# EAGLE design LineFollower (EAGLE 9.2.2)
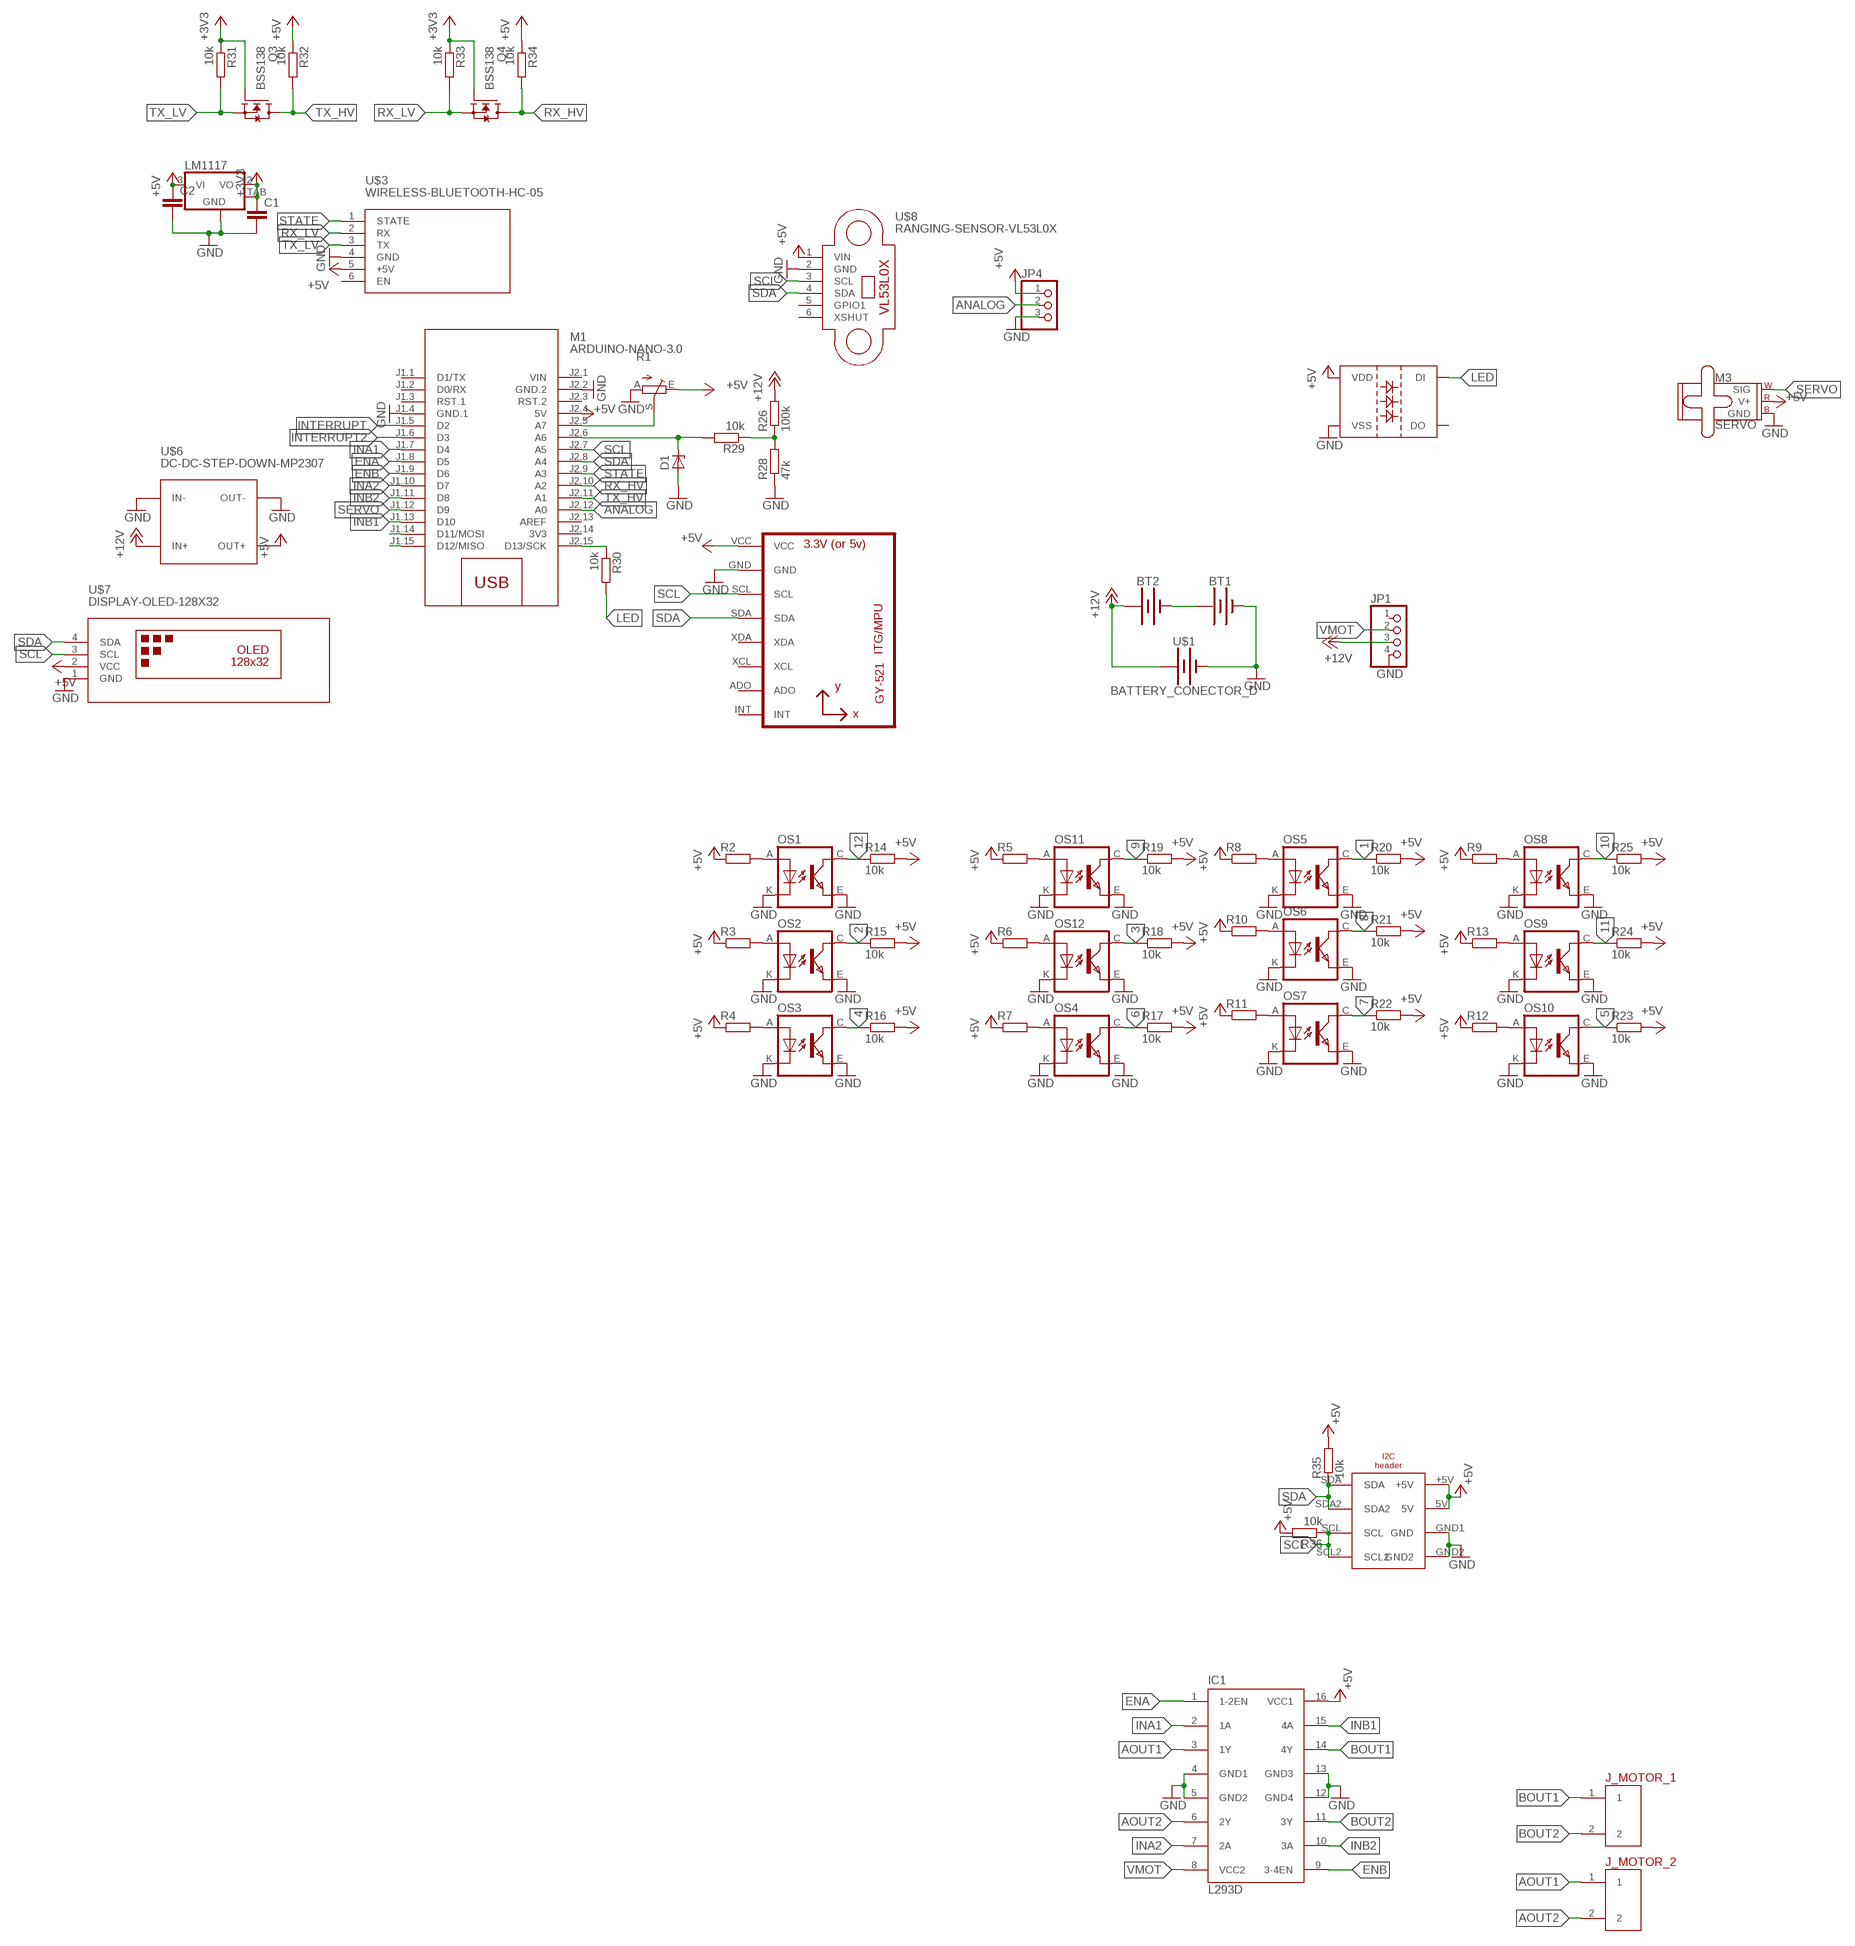
[diagram p0: schematic, sheet 1, part 1 of 2]
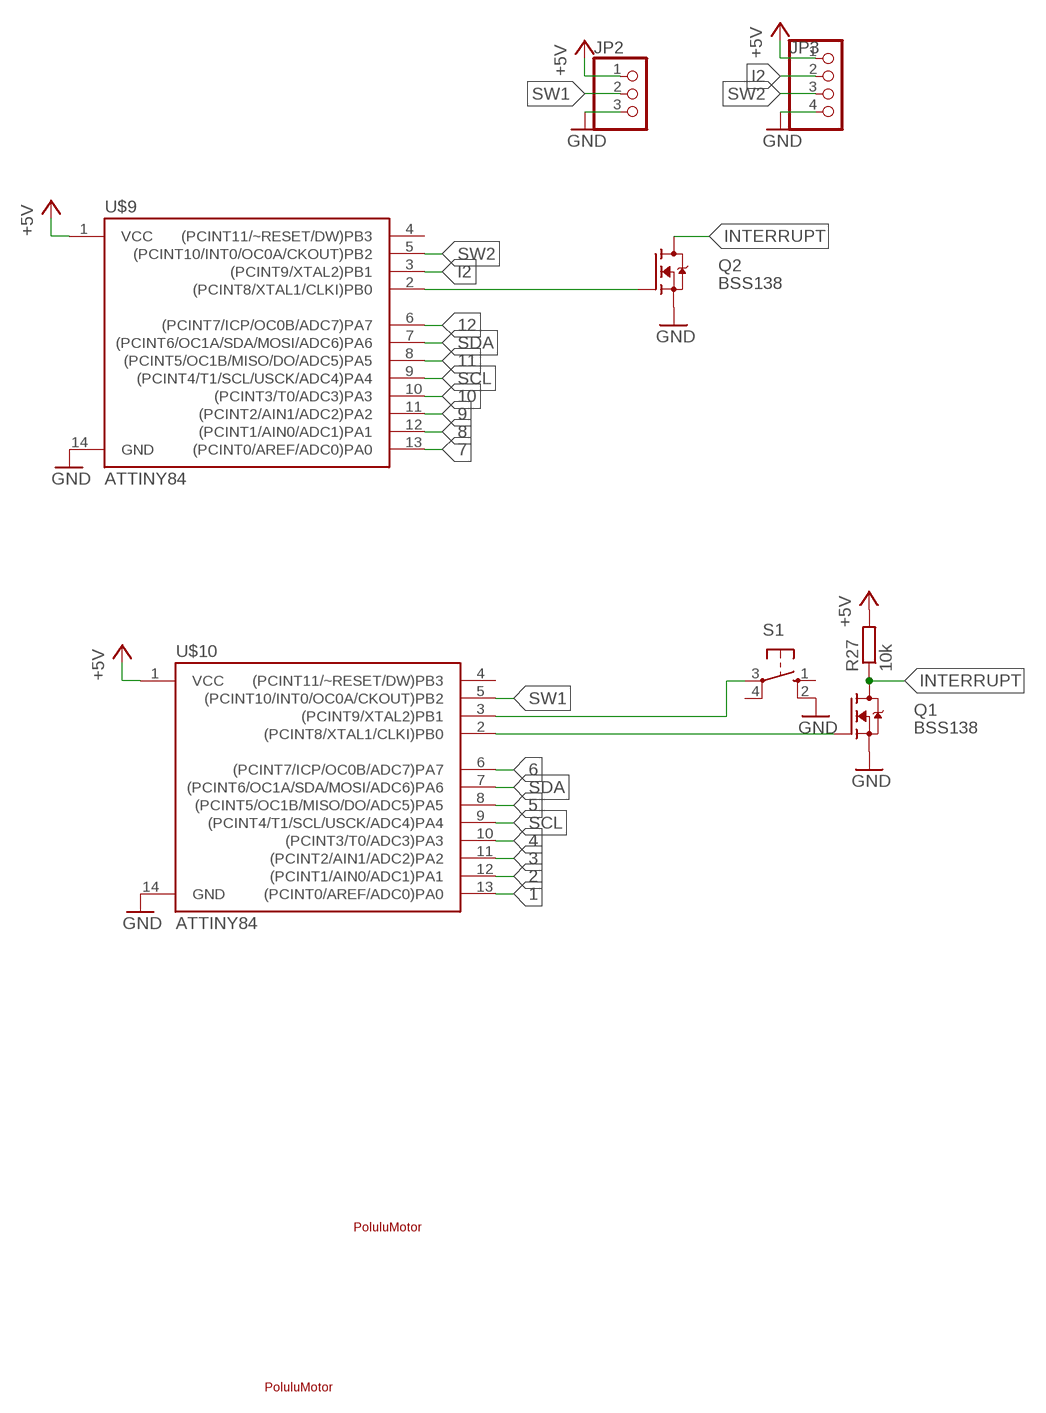
[diagram p1: schematic, sheet 1, part 2 of 2]

## Parts
BT1  BATTERY-AA_KIT  [BATTERY-AA-KIT]
BT2  BATTERY-AA_KIT  [BATTERY-AA-KIT]
C1  C-EUC1206  [C1206]
C2  C-EUC1206  [C1206]
D1  ZENER-DIODESOD80C  [SOD80C]
IC1  L293D  [L293]
J_MOTOR_1  MOTOR_CONNECTOR  [MOTOR_CONNECTOR_FOOTPRINT]
J_MOTOR_2  MOTOR_CONNECTOR  [MOTOR_CONNECTOR_FOOTPRINT]
JP1  PINHD-1X4  [1X04]
JP2  PINHD-1X3  [1X03]
JP3  PINHD-1X4  [1X04]
JP4  PINHD-1X3  [1X03]
LED1  WS2812B  [WS2812B]
M1  ARDUINO-NANO-3.0  [ARDUINO-NANO-3.0]
M3  SERVO  [1X03]
OS1  TCRT5000  [TCRT5000]
OS2  TCRT5000  [TCRT5000]
OS3  TCRT5000  [TCRT5000]
OS4  TCRT5000  [TCRT5000]
OS5  TCRT5000  [TCRT5000]
OS6  TCRT5000  [TCRT5000]
OS7  TCRT5000  [TCRT5000]
OS8  TCRT5000  [TCRT5000]
OS9  TCRT5000  [TCRT5000]
OS10  TCRT5000  [TCRT5000]
OS11  TCRT5000  [TCRT5000]
OS12  TCRT5000  [TCRT5000]
Q1  BSS138  [SOT23]
Q2  BSS138  [SOT23]
Q3  BSS138  [SOT23]
Q4  BSS138  [SOT23]
R1  TRIM_EU-RJ9W  [RJ9W]
R2  R-EU_M1206  [M1206]
R3  R-EU_M1206  [M1206]
R4  R-EU_M1206  [M1206]
R5  R-EU_M1206  [M1206]
R6  R-EU_M1206  [M1206]
R7  R-EU_M1206  [M1206]
R8  R-EU_M1206  [M1206]
R9  R-EU_M1206  [M1206]
R10  R-EU_M1206  [M1206]
R11  R-EU_M1206  [M1206]
R12  R-EU_M1206  [M1206]
R13  R-EU_M1206  [M1206]
R14  10k  R-EU_M1206  [M1206]
R15  10k  R-EU_M1206  [M1206]
R16  10k  R-EU_M1206  [M1206]
R17  10k  R-EU_M1206  [M1206]
R18  10k  R-EU_M1206  [M1206]
R19  10k  R-EU_M1206  [M1206]
R20  10k  R-EU_M1206  [M1206]
R21  10k  R-EU_M1206  [M1206]
R22  10k  R-EU_M1206  [M1206]
R23  10k  R-EU_M1206  [M1206]
R24  10k  R-EU_M1206  [M1206]
R25  10k  R-EU_M1206  [M1206]
R26  100k  R-EU_M1206  [M1206]
R27  10k  R-EU_M1206  [M1206]
R28  47k  R-EU_M1206  [M1206]
R29  10k  R-EU_M1206  [M1206]
R30  10k  R-EU_M1206  [M1206]
R31  10k  R-EU_M1206  [M1206]
R32  10k  R-EU_M1206  [M1206]
R33  10k  R-EU_M1206  [M1206]
R34  10k  R-EU_M1206  [M1206]
R35  10k  R-EU_M1206  [M1206]
R36  10k  R-EU_M1206  [M1206]
S1  10-XX  [B3F-10XX]
U1  MPU-6050MPU6050  [MPU-6050]
U$1  BATTERY_CONECTOR_D  [BATTERY_CONECTOR_D]
U$2  I2C_HEADER  [I2_HEADER]
U$3  WIRELESS-BLUETOOTH-HC-05  [WIRELESS-BLUETOOTH-HC-05]
U$4  LM1117  [LM1117]
U$6  DC-DC-STEP-DOWN-MP2307  [DC-DC-STEP-DOWN-MP2307]
U$7  DISPLAY-OLED-128X32  [DISPLAY-OLED-128X32]
U$8  RANGING-SENSOR-VL53L0X  [RANGING-SENSOR-VL53L0X]
U$9  ATTINY84  [SO14]
U$10  ATTINY84  [SO14]
U$12  POLULU_MOTOR  [POLULU_MOTOR]
U$13  POLULU_MOTOR  [POLULU_MOTOR]

## Nets
1: OS5.C(COLLECTOR) R20.1 U$10.13((PCINT0/AREF/ADC0)PA0)
2: OS2.C(COLLECTOR) R15.1 U$10.12((PCINT1/AIN0/ADC1)PA1)
3: OS12.C(COLLECTOR) R18.1 U$10.11((PCINT2/AIN1/ADC2)PA2)
4: OS3.C(COLLECTOR) R16.1 U$10.10((PCINT3/T0/ADC3)PA3)
5: OS10.C(COLLECTOR) R23.1 U$10.8((PCINT5/OC1B/MISO/DO/ADC5)PA5)
6: OS4.C(COLLECTOR) R17.1 U$10.6((PCINT7/ICP/OC0B/ADC7)PA7)
7: OS7.C(COLLECTOR) R22.1 U$9.13((PCINT0/AREF/ADC0)PA0)
8: OS6.C(COLLECTOR) R21.1 U$9.12((PCINT1/AIN0/ADC1)PA1)
9: OS11.C(COLLECTOR) R19.1 U$9.11((PCINT2/AIN1/ADC2)PA2)
10: OS8.C(COLLECTOR) R25.1 U$9.10((PCINT3/T0/ADC3)PA3)
11: OS9.C(COLLECTOR) R24.1 U$9.8((PCINT5/OC1B/MISO/DO/ADC5)PA5)
12: OS1.C(COLLECTOR) R14.1 U$9.6((PCINT7/ICP/OC0B/ADC7)PA7)
+3V3: C1.1 Q3.1(G) Q4.1(G) R31.1 R33.1 U$4.2(VO) U$4.TAB(OUT)
+5V: C2.1 IC1.16(VCC1) JP2.1 JP3.1 JP4.1 LED1.1(VDD) M1.J2.4(5V) M3.2(V+) R1.E R2.1 R3.1 R4.1 R5.1 R6.1 R7.1 R8.1 R9.1 R10.1 R11.1 R12.1 R13.1 R14.2 R15.2 R16.2 R17.2 R18.2 R19.2 R20.2 R21.2 R22.2 R23.2 R24.2 R25.2 R27.2 R32.1 R34.1 R35.2 R36.2 U1.VCC U$2.5V U$2.+5V U$3.5(+5V) U$4.3(VI) U$6.OUT+ U$7.2(VCC) U$8.1(VIN) U$9.1(VCC) U$10.1(VCC)
+12V: BT2.PWR@1(+) JP1.3 R26.2 U$1.+ U$6.IN+
ANALOG: JP4.2 M1.J2.12(A0)
AOUT1: IC1.3(1Y) J_MOTOR_2.1
AOUT2: IC1.6(2Y) J_MOTOR_2.2
BOUT1: IC1.14(4Y) J_MOTOR_1.1
BOUT2: IC1.11(3Y) J_MOTOR_1.2
ENA: IC1.1(1-2EN) M1.J1.8(D5)
ENB: IC1.9(3-4EN) M1.J1.9(D6)
GND: BT1.GND@1(-) C1.2 C2.2 D1.A IC1.4(GND1) IC1.5(GND2) IC1.12(GND4) IC1.13(GND3) JP1.4 JP2.3 JP3.4 JP4.3 LED1.3(VSS) M1.J1.4(GND.1) M1.J2.2(GND.2) M3.3(GND) OS1.E(EMITTER) OS1.K(CATHODE) OS2.E(EMITTER) OS2.K(CATHODE) OS3.E(EMITTER) OS3.K(CATHODE) OS4.E(EMITTER) OS4.K(CATHODE) OS5.E(EMITTER) OS5.K(CATHODE) OS6.E(EMITTER) OS6.K(CATHODE) OS7.E(EMITTER) OS7.K(CATHODE) OS8.E(EMITTER) OS8.K(CATHODE) OS9.E(EMITTER) OS9.K(CATHODE) OS10.E(EMITTER) OS10.K(CATHODE) OS11.E(EMITTER) OS11.K(CATHODE) OS12.E(EMITTER) OS12.K(CATHODE) Q1.2(S) Q2.2(S) R1.A R28.1 S1.2(S1) U1.GND U$1.- U$2.GND1(GND) U$2.GND2 U$3.4(GND) U$4.1(GND) U$6.IN- U$6.OUT- U$7.1(GND) U$8.2(GND) U$9.14(GND) U$10.14(GND)
I2: JP3.2 U$9.3((PCINT9/XTAL2)PB1)
INA1: IC1.2(1A) M1.J1.7(D4)
INA2: IC1.7(2A) M1.J1.10(D7)
INB1: IC1.15(4A) M1.J1.13(D10)
INB2: IC1.10(3A) M1.J1.11(D8)
INTERRUPT: M1.J1.5(D2) Q1.3(D) Q2.3(D) R27.1
INTERRUPT2: M1.J1.6(D3)
LED: LED1.4(DI) R30.2
N$1: M1.J2.5(A7) R1.S
N$2: BT1.PWR@1(+) BT2.GND@1(-)
N$3: Q1.1(G) U$10.2((PCINT8/XTAL1/CLKI)PB0)
N$4: Q2.1(G) U$9.2((PCINT8/XTAL1/CLKI)PB0)
N$5: S1.3(P) U$10.3((PCINT9/XTAL2)PB1)
N$6: R26.1 R28.2 R29.1
N$7: OS1.A(ANODE) R2.2
N$8: OS2.A(ANODE) R3.2
N$9: OS3.A(ANODE) R4.2
N$10: OS11.A(ANODE) R5.2
N$11: OS12.A(ANODE) R6.2
N$12: OS4.A(ANODE) R7.2
N$13: OS5.A(ANODE) R8.2
N$14: OS6.A(ANODE) R10.2
N$15: OS7.A(ANODE) R11.2
N$16: OS10.A(ANODE) R12.2
N$17: OS9.A(ANODE) R13.2
N$18: OS8.A(ANODE) R9.2
N$19: D1.C M1.J2.6(A6) R29.2
N$20: M1.J2.15(D13/SCK) R30.1
N$21: M1.J1.15(D12/MISO)
N$22: M1.J1.14(D11/MOSI)
RX_HV: M1.J2.10(A2) Q4.3(D) R34.2
RX_LV: Q4.2(S) R33.2 U$3.2(RX)
SCL: M1.J2.7(A5) R36.1 U1.SCL U$2.SCL U$2.SCL2 U$7.3(SCL) U$8.3(SCL) U$9.9((PCINT4/T1/SCL/USCK/ADC4)PA4) U$10.9((PCINT4/T1/SCL/USCK/ADC4)PA4)
SDA: M1.J2.8(A4) R35.1 U1.SDA U$2.SDA U$2.SDA2 U$7.4(SDA) U$8.4(SDA) U$9.7((PCINT6/OC1A/SDA/MOSI/ADC6)PA6) U$10.7((PCINT6/OC1A/SDA/MOSI/ADC6)PA6)
SERVO: M1.J1.12(D9) M3.1(SIG)
STATE: M1.J2.9(A3) U$3.1(STATE)
SW1: JP2.2 U$10.5((PCINT10/INT0/OC0A/CKOUT)PB2)
SW2: JP3.3 U$9.5((PCINT10/INT0/OC0A/CKOUT)PB2)
TX_HV: M1.J2.11(A1) Q3.3(D) R32.2
TX_LV: Q3.2(S) R31.2 U$3.3(TX)
VMOT: IC1.8(VCC2) JP1.2
Unconnected: JP1.1 LED1.2(DO) M1.J1.1(D1/TX) M1.J1.2(D0/RX) M1.J1.3(RST.1) M1.J2.3(RST.2) M1.J2.13(AREF) S1.1(S) S1.4(P1) U1.ADO U1.INT U1.XCL U1.XDA U$3.6(EN) U$8.5(GPIO1) U$8.6(XSHUT) U$9.4((PCINT11/~RESET/DW)PB3) U$10.4((PCINT11/~RESET/DW)PB3)

## Power pins joined to a net without a drawn wire
3V3: M1.J2.14(3V3)
VIN: M1.J2.1(VIN)

## Library data of the parts
BT1 BT2 = Cing Library:BATTERY: Battery - Single Cell A variety of battery chemistries, sizes, and footprints. Device List: 20MM_PTH - Coin Cell Battery Holder - 20mm (PTH) <https://www.sparkfun.com/products/783> 6.8MM_PTH - Coin Cell Battery Holder - 6.8MM(SMD) <https://www.digikey.com/product-detail/en/seiko-instruments/MS621FE-FL11E/728-1057-ND/1889208?WT.srch=1&gclid=CNOQ5a6LzdQCFZS2wAodXCkE0g> 12MM_SMD - Coin Cell Battery Holder - 12mm (SMD) <https://www.sparkfun.com/products/10592> 12MM_PTH - Coin Cell Battery Holder - 12mm (PTH) <https://www.sparkfun.com/products/7948> 20MM_SMD - 20mm Coin Cell Battery Holder (SMD) (2 legs) Used on the Big Time Watch Kit <https://www.sparkfun.com/products/11734> 20MM_SMD_4LEGS - Coin Cell Battery Holder - 20mm (SMD) <https://www.sparkfun.com/products/11892> 20MM_SMD_4LEGS_OVERPASTE - Coin Cell Battery Holder - 20mm (SMD) <https://www.sparkfun.com/products/11892> (Over-paste on the legs) 24.5MM_PTH - Coin Cell Battery Holder - 24.5mm (PTH) <https://www.sparkfun.com/products/8863> 9V - 9V Battery Holder - PC Mount Used on the SparkFun SparkPunk Sound Kit <https://www.sparkfun.com/products/11177> and SparkFun SparkPunk Sequencer Kit <https://www.sparkfun.com/products/12707> 18650 - Battery Holder - 18650 (PTH) <https://www.sparkfun.com/products/13113> AA - Battery Holder - 1xAA (PTH) <https://www.sparkfun.com/products/7949> AAA - Battery Holder - 1xAAA (PTH) <https://www.sparkfun.com/products/12718> AA_KIT - Battery Holder - 1xAA (PTH) <https://www.sparkfun.com/products/7949> Special kit package - pads only have exposed copper on one side of the board. AAA_KIT - Battery Holder - 1xAAA (PTH) <https://www.sparkfun.com/products/12718> Special kit package - pads only have exposed copper on one side of the board.; PROD_ID: BATT-08316; SF_SKU: PRT-07949
C1 C2 = rcl:C-EU: CAPACITOR, European symbol; SPICEPREFIX: C
D1 = diode:ZENER-DIODE: Z-Diode
IC1 = Cing Library:L293D: PUSH-PULL 4 CHANNEL DRIVER; MPN: L293D; OC_FARNELL: 9589619; OC_NEWARK: 56P8249
J_MOTOR_1 J_MOTOR_2 = Pololu Encoder and Motor Driver:MOTOR_CONNECTOR: Connector for a Motor
JP1 JP3 = pinhead:PINHD-1X4: PIN HEADER
JP2 JP4 = pinhead:PINHD-1X3: PIN HEADER
LED1 = Cing Library:WS2812B
M1 = diy-modules:ARDUINO-NANO-3.0: Arduino Nano 3.0 and compatible devices More details available here: https://www.arduino.cc/en/Main/ArduinoBoardNano Click here to find device on ebay.com <http://www.ebay.com/sch/arduino+nano>
M3 = SparkFun-Electromechanical:SERVO: Servo Motor 3-pin connector for a standard servo motor (voltage supply, ground, and control signal.) SparkFun Products Servo - Generic (Sub-Micro Size) <https://www.sparkfun.com/products/9065> (ROB-09065) Servo - Generic High Torque Continuous Rotation (Standard Size) <https://www.sparkfun.com/products/9347> (ROB-09347) Servo - Generic High Torque (Standard Size) <https://www.sparkfun.com/products/11965> (ROB-11965)
OS1-OS12 = Cing Library:TCRT5000
Q1-Q4 = Cing Library:BSS138: BSS138 N-Channel Logic Level Enhancement Mode Field Effect Transistor Source: http://www.fairchildsemi.com/datasheets/BS/BSS138.pdf; MF: Fairchild; MPN: BSS138; OC_FARNELL: 9845330; OC_NEWARK: 67R2009
R1 = pot:TRIM_EU-: POTENTIOMETER
R2-R36 = rcl:R-EU_: RESISTOR, European symbol; SPICEPREFIX: R
S1 = switch-omron:10-XX: OMRON SWITCH; MPN: B3F-1000; OC_FARNELL: 176432; OC_NEWARK: 36M3542
U1 = Cing Library:MPU-6050
U$1 = Cing Library:BATTERY_CONECTOR_D
U$2 = Cing Library:I2C_HEADER
U$3 = Cing Library:WIRELESS-BLUETOOTH-HC-05: Bluetooth Transceiver Module based on HC-05 board Tutorial is available here: https://arduino-info.wikispaces.com/BlueTooth-HC05-HC06-Modules-How-To Click here to find device on ebay.com <http://www.ebay.com/sch/hc-05+module+rs232>
U$4 = Cing Library:LM1117
U$6 = diy-modules:DC-DC-STEP-DOWN-MP2307: DC/DC Step-Down Regulator based on MP2307DN chip MP2307 datasheet available here: https://cdn-shop.adafruit.com/datasheets/MP2307_r1.9.pdf Click here to find device on ebay.com <http://www.ebay.com/sch/dc+dc+3a+mini+converter>
U$7 = diy-modules:DISPLAY-OLED-128X32: 128x32 Dot Matrix OLED Module with I2C interface based on SSD1306 chip More details available here: http://www.tinyosshop.com/index.php?route=product/product&product_id=953 Schematic available here: http://www.tinyosshop.com/datasheet/OLED%2012832.pdf SSD1306 datasheet: https://cdn-shop.adafruit.com/datasheets/SSD1306.pdf Click here to find device on ebay.com <http://www.ebay.com/sch/oled+display+128x32+i2c>
U$8 = diy-modules:RANGING-SENSOR-VL53L0X: Laser Ranging Sensor based on VL53L0X device More information about VL53L0X device can be found here: http://www.st.com/en/imaging-and-photonics-solutions/vl53l0x.html Arduino Library for VL53L0X is available here: https://github.com/pololu/vl53l0x-arduino Click here to find device on ebay.com <http://www.ebay.com/sch/GY+VL53L0X+module> Note: There are many variants. Search for the proper version.
U$9 U$10 = SparkFun-IC-Microcontroller:ATTINY84: Atmel 14-pin 2/4/8kB flash uC Datasheet <https://cdn.sparkfun.com/datasheets/Widgets/doc8006.pdf> SparkFun Products Tiny AVR Programmer <https://www.sparkfun.com/products/11801> (PGM-11801) SparkFun Servo Trigger - Continuous Rotation <https://www.sparkfun.com/products/13872> (WIG-13872) SparkFun Servo Trigger <https://www.sparkfun.com/products/13118> (WIG-13118); PROD_ID: IC-11285
U$12 U$13 = Cing Library:POLULU_MOTOR

## Board
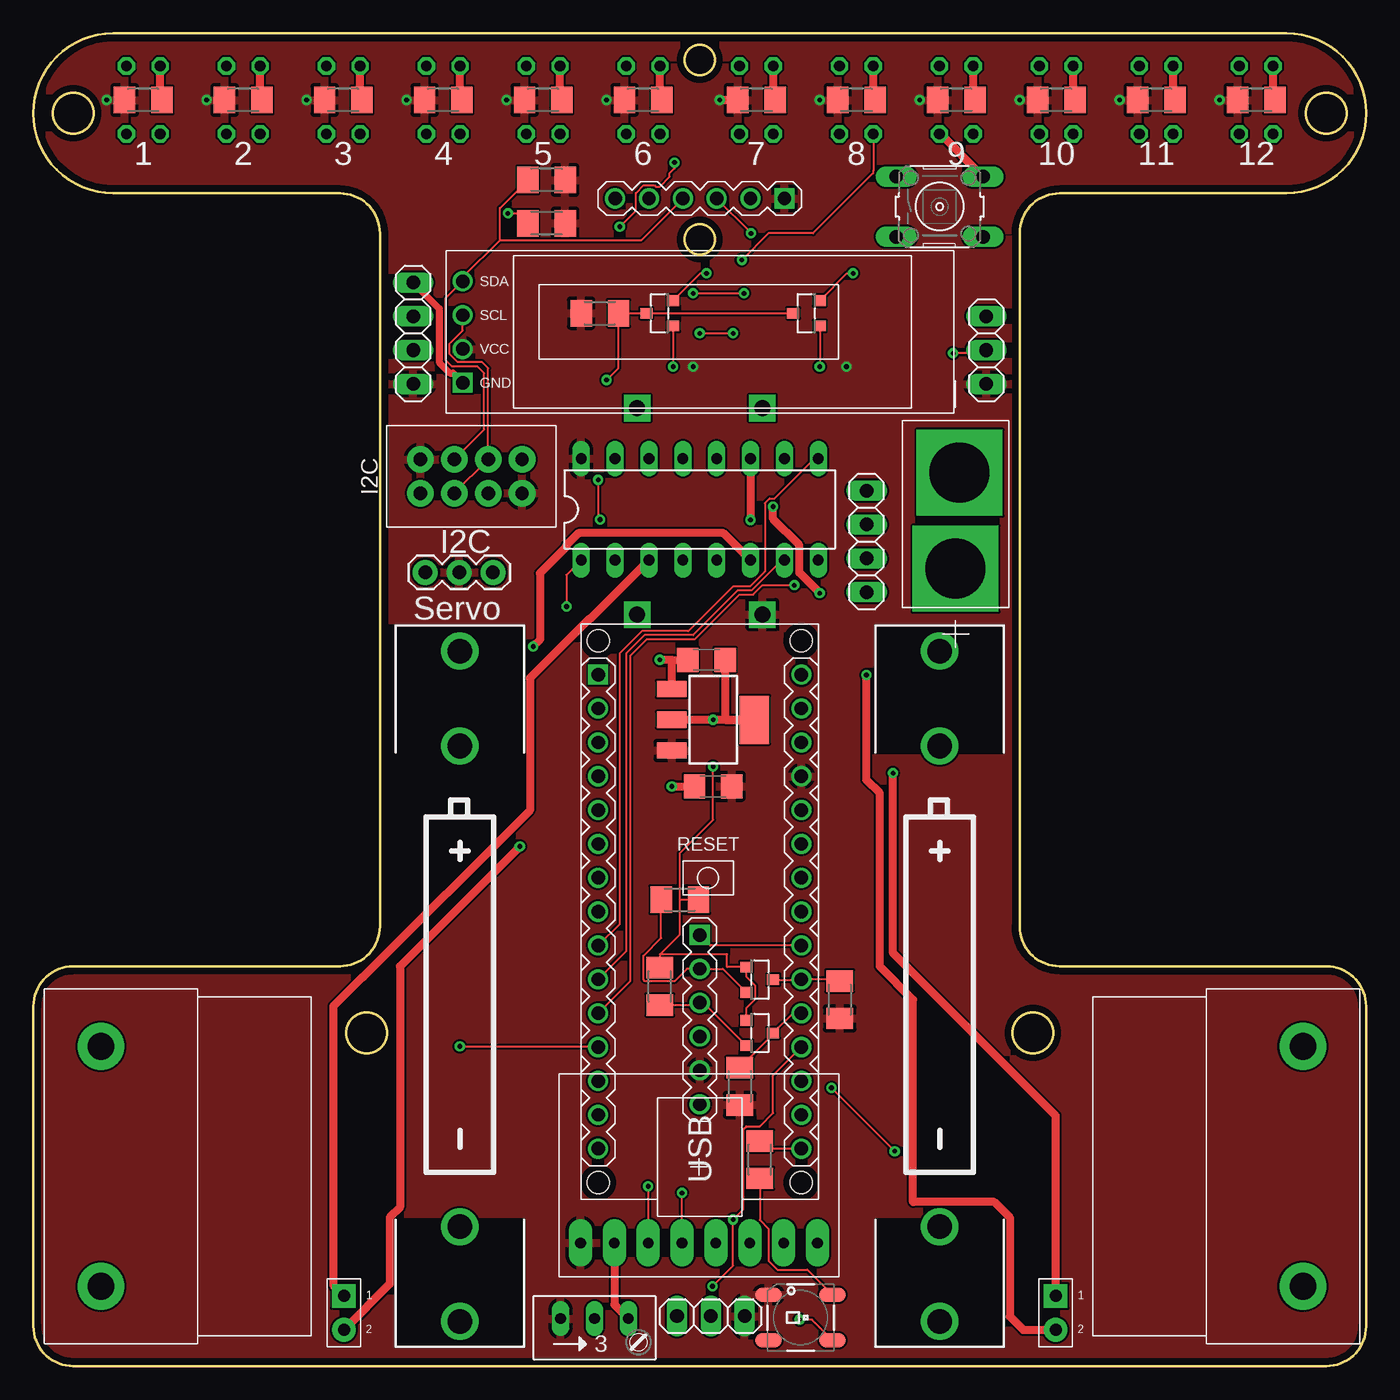
[diagram p2: board, top side]
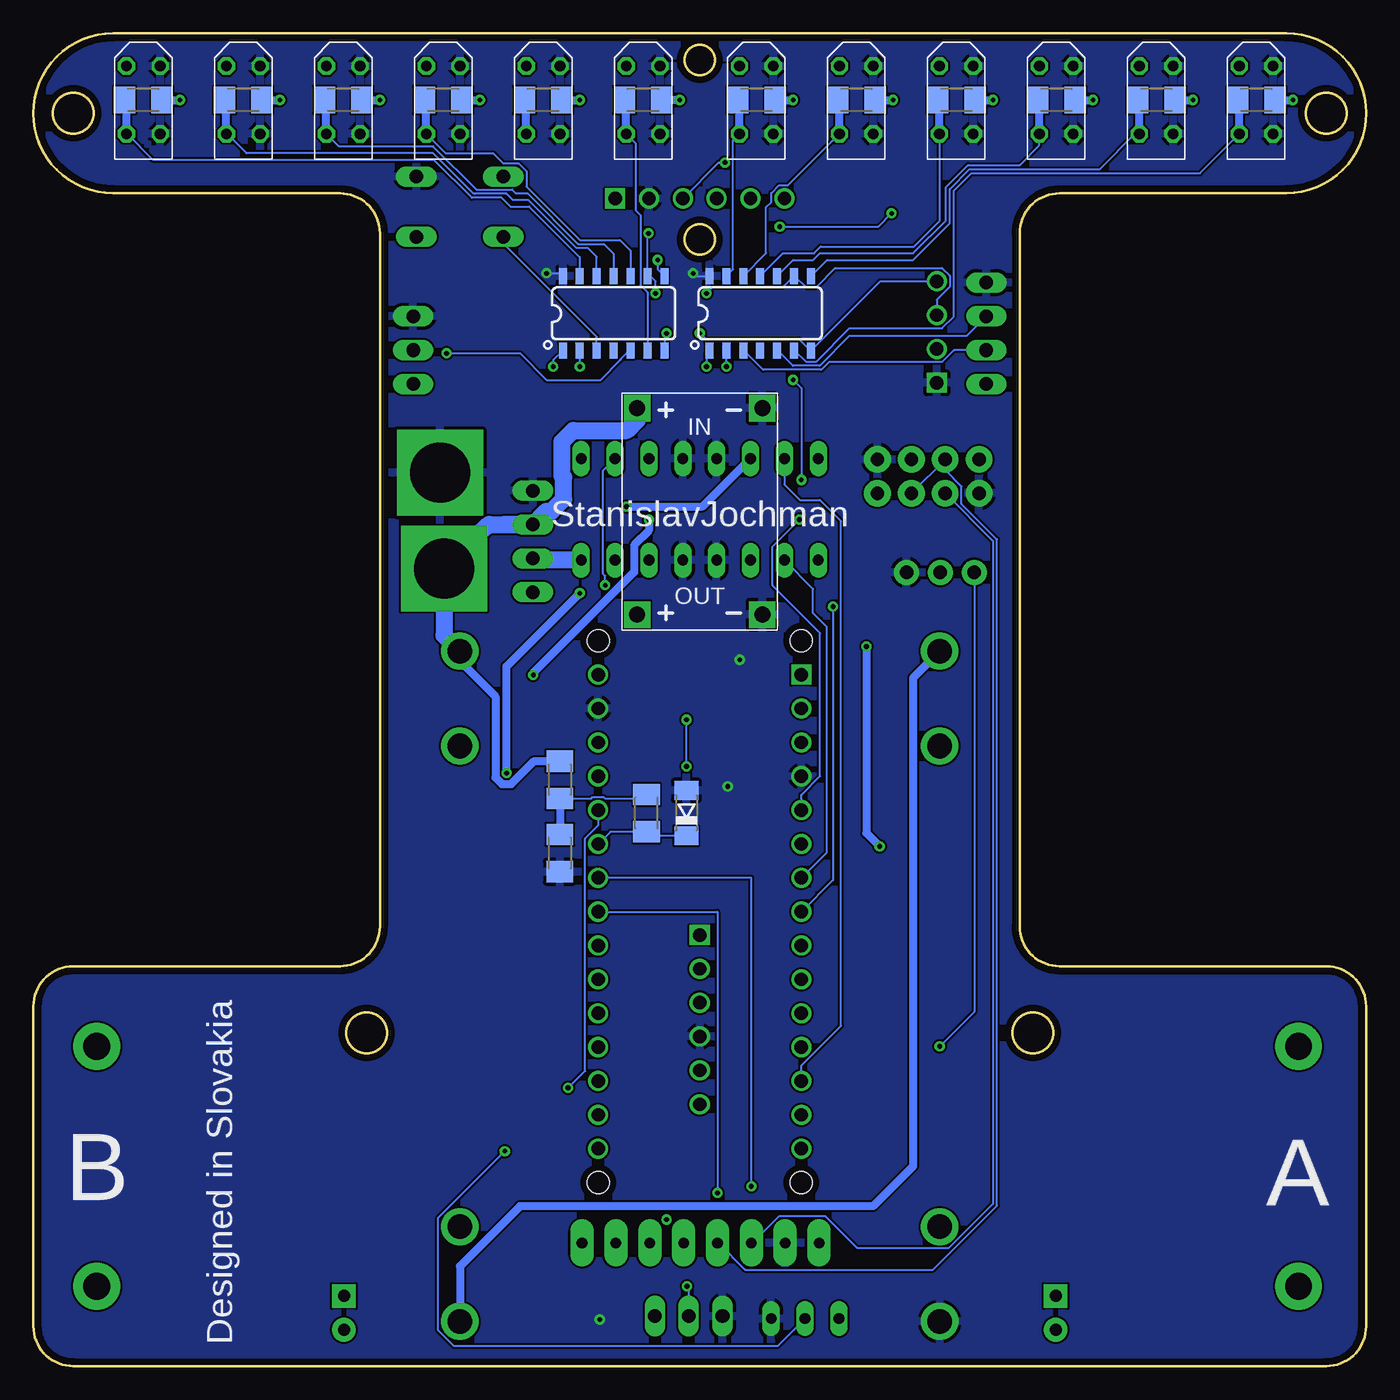
[diagram p3: board, bottom side, seen from below]

Size 100 x 100 mm. Coordinates in mm from the lower left corner, seen from the top.
Outline: 6,100 94,100 arc-180 94,88 77,88 arc90 74,85 74,33 arc90 77,30 97,30 arc-90 100,27 100,3 arc-90 97,0 3,0 arc-90 0,3 0,27 arc-90 3,30 23,30 arc90 26,33 26,85 arc90 23,88 6,88 arc-180 6,100
Outline: circle at 97,94 radius 1.5
Outline: circle at 3,94 radius 1.5
Outline: circle at 75,25 radius 1.5
Outline: circle at 25,25 radius 1.5
Outline: circle at 50,98 radius 1.1
Outline: circle at 50,84.54 radius 1.1
Copper layers (1*16): Top 0.035mm / dielectric 1.5mm / Bottom 0.035mm
Design rules "default *": minimum track width 6mil, minimum drill 0.35mm, track to track 6mil, track to pad 6mil, pad to pad 6mil, via to via 6mil, smd to smd 6mil, copper to edge 20mil, drill to drill 6mil, minimum pad ring 10mil, minimum via ring 8mil, stop-mask expansion 4mil, vias tented up to drill 0mil, thermal gap 10mil
Holes 3 mm at 75,25 25,25 3,94 97,94
Holes 2.2 mm at 50,98 50,84.54

### Footprints (pad centres in the part's own frame; a part is rotated, then mirrored left to right if it is on the bottom)
BATTERY-AA-KIT = drill 1.854: GND@1 25.146,0; GND@2 18.034,0; PWR@1 -25.146,0; PWR@2 -18.034,0
C1206 = smd 1.6 x 1.8: 1 -1.4,0; 2 1.4,0
SOD80C = smd 1.4 x 1.8: A 1.7,0; C -1.7,0
L293 = drill 0.813 long: 1 -8.89,-3.81; 2 -6.35,-3.81; 3 -3.81,-3.81; 4 -1.27,-3.81; 5 1.27,-3.81; 6 3.81,-3.81; 7 6.35,-3.81; 8 8.89,-3.81; 9 8.89,3.81; 10 6.35,3.81; 11 3.81,3.81; 12 1.27,3.81; 13 -1.27,3.81; 14 -3.81,3.81; 15 -6.35,3.81; 16 -8.89,3.81
MOTOR_CONNECTOR_FOOTPRINT = drill 0.9 pad 1.778 square: 1 0,1.27 | drill 0.9 pad 1.778: 2 0,-1.27
1X04 = drill 1.016 long: 1 -3.81,0; 2 -1.27,0; 3 1.27,0; 4 3.81,0
1X03 = drill 1.016 long: 1 -2.54,0; 2 0,0; 3 2.54,0
WS2812B = smd 2 x 1.1: 1 -2.4,1.7; 2 -2.4,-1.7; 3 2.4,-1.7; 4 2.4,1.7
ARDUINO-NANO-3.0 = drill 1 square: J1.1 17.78,7.62 | drill 1: J1.2 15.24,7.62; J1.3 12.7,7.62; J1.4 10.16,7.62; J1.5 7.62,7.62; J1.6 5.08,7.62; J1.7 2.54,7.62; J1.8 0,7.62; J1.9 -2.54,7.62; J1.10 -5.08,7.62; J1.11 -7.62,7.62; J1.12 -10.16,7.62; J1.13 -12.7,7.62; J1.14 -15.24,7.62; J1.15 -17.78,7.62; J2.1 17.78,-7.62; J2.2 15.24,-7.62; J2.3 12.7,-7.62; J2.4 10.16,-7.62; J2.5 7.62,-7.62; J2.6 5.08,-7.62; J2.7 2.54,-7.62; J2.8 0,-7.62; J2.9 -2.54,-7.62; J2.10 -5.08,-7.62; J2.11 -7.62,-7.62; J2.12 -10.16,-7.62; J2.13 -12.7,-7.62; J2.14 -15.24,-7.62; J2.15 -17.78,-7.62 | hole 1.651: -20.32,7.62; -20.32,-7.62; 20.32,-7.62; 20.32,7.62
1X03' = drill 1.016 pad 1.88: 1 0,0; 2 2.54,0; 3 5.08,0
TCRT5000 = drill 0.8 octagon: A -2.54,1.27; C 2.54,1.27; E 2.54,-1.27; K -2.54,-1.27
SOT23 = smd 0.8 x 0.9: 1 -0.95,-1; 2 0.95,-1; 3 0,1
RJ9W = drill 0.813 long: A 2.54,0.635; E -2.54,0.635; S 0,0.635
M1206 = smd 1.6 x 2: 1 -1.4,0; 2 1.4,0
B3F-10XX = drill 1.016 long: 1 -3.251,2.261; 2 3.251,2.261; 3 -3.251,-2.261; 4 3.251,-2.261
MPU-6050 = drill 0.8 pad 1.778 long: ADO 0,-6.35; GND 0,6.35; INT 0,-8.89; SCL 0,3.81; SDA 0,1.27; VCC 0,8.89; XCL 0,-3.81; XDA 0,-1.27
BATTERY_CONECTOR_D = drill 4.5 pad 6.452 square: + 4.1,0; - -3.1,0.3
I2_HEADER = drill 1 pad 2: 5V 1.27,3.81; +5V -1.27,-3.81; GND1 -1.27,3.81; GND2 1.27,-3.81; SCL 1.27,-1.27; SCL2 -1.27,1.27; SDA 1.27,1.27; SDA2 -1.27,-1.27
WIRELESS-BLUETOOTH-HC-05 = drill 1 square: 1 -6.35,0 | drill 1: 2 -3.81,0; 3 -1.27,0; 4 1.27,0; 5 3.81,0; 6 6.35,0
LM1117 = smd 1.219 x 2.235: 1 -2.311,-3.099; 2 0,-3.099; 3 2.311,-3.099 | smd 3.6 x 2.2: TAB 0,3.099
DC-DC-STEP-DOWN-MP2307 = drill 1.2 pad 2 square: IN+ -7.747,-4.699; IN- -7.747,4.699; OUT+ 7.747,-4.699; OUT- 7.747,4.699
DISPLAY-OLED-128X32 = drill 1 square: 1 -17.78,-3.81 | drill 1: 2 -17.78,-1.27; 3 -17.78,1.27; 4 -17.78,3.81
RANGING-SENSOR-VL53L0X = drill 1 square: 1 -3.81,6.35 | drill 1: 2 -3.81,3.81; 3 -3.81,1.27; 4 -3.81,-1.27; 5 -3.81,-3.81; 6 -3.81,-6.35
SO14 = smd 0.6 x 1.2: 1 -3.175,-2.8; 2 -1.905,-2.8; 3 -0.635,-2.8; 4 0.635,-2.8; 5 1.905,-2.8; 6 3.175,-2.8; 7 4.445,-2.8; 8 4.445,2.8; 9 3.175,2.8; 10 1.905,2.8; 11 0.635,2.8; 12 -0.635,2.8; 13 -1.905,2.8; 14 -3.175,2.8
POLULU_MOTOR = drill 2 pad 3.5: P$1 0,9; P$2 0,-9

### Placement (x,y rotation side)
BT1  32,28.5 270 top
BT2  68,28.5 270 top
C1  50.5,53 180 top
C2  51,43.5 180 top
D1  51,41.5 90 bottom
IC1  50,64.28 0 top
J_MOTOR_1  76.7,4 0 top
J_MOTOR_2  23.3,4 0 top
JP1  62.52,61.88 90 top
JP2  71.5,76.23 90 top
JP3  28.5,77.5 90 top
JP4  50.83,3.76 180 top
LED1  57.57,3.65 0 top
M1  50,34.1 90 top
M3  SERVO  [1X03']  29.41,59.56 0 top
OS1  8.25,95 270 top
OS2  84.25,95 270 top
OS3  69.25,95 270 top
OS4  54.25,95 270 top
OS5  91.75,95 270 top
OS6  38.25,95 270 top
OS7  45.75,95 270 top
OS8  23.25,95 270 top
OS9  15.75,95 270 top
OS10  61.75,95 270 top
OS11  30.75,95 270 top
OS12  76.75,95 270 top
Q1  58,79 90 top
Q2  47,79 90 top
Q3  54.5,25 270 top
Q4  54.5,29 270 top
R1  42.1,2.94 0 top
R2  8.25,95 0 top
R3  84.25,95 0 top
R4  69.25,95 0 top
R5  30.75,95 0 top
R6  76.75,95 0 top
R7  54.25,95 0 top
R8  91.75,95 0 top
R9  23.25,95 0 top
R10  38.25,95 0 top
R11  45.75,95 0 top
R12  61.75,95 0 top
R13  15.75,95 0 top
R14  8.25,95 0 bottom
R15  84.25,95 0 bottom
R16  69.25,95 0 bottom
R17  54.25,95 0 bottom
R18  76.75,95 0 bottom
R19  30.75,95 0 bottom
R20  91.75,95 0 bottom
R21  38.25,95 0 bottom
R22  45.75,95 0 bottom
R23  61.75,95 0 bottom
R24  15.75,95 0 bottom
R25  23.25,95 0 bottom
R26  60.5,44 90 bottom
R27  42.5,79 180 top
R28  60.5,38.5 90 bottom
R29  54,41.5 270 bottom
R30  54.5,15.5 270 top
R31  47,28.5 270 top
R32  53,21 90 top
R33  48.5,35 180 top
R34  60.5,27.5 90 top
R35  38.5,89 0 top
R36  38.5,85.75 0 top
S1  68,87 0 top
U1  49.94,9.25 90 top
U$1  69.19,63.93 270 top
U$2  32.86,66.76 90 top
U$3  50,26 270 top
U$4  51,48.5 270 top
U$6  50,64.13 270 bottom
U$7  50,77.59 0 top
U$8  50,83.8 270 top
U$9  46.1,79 0 bottom
U$10  57.1,79 0 bottom
U$12  95.25,15 0 top
U$13  5.08,15 180 top

### Tracks (layer width: path | path; a pad name or v marks a point on that pad's centre or on a via)
1
  Bottom 0.152: OS5.C 92.96,92.46 91,90.5 69.93,90.5 67.09,87.66 64.86,87.66 64.2,87 62.79,87 59.01,83.21 U$10.13
  Bottom 0.61: R20.1 93.02,95 OS5.C
2
  Bottom 0.152: OS2.C 85.46,92.46 84,91 70,91 67,88 66.92,88 66.89,87.97 64.5,87.97 64.02,87.48 64,87.5 63,87.5 62.86,87.5 59.25,83.89 58.39,83.89 57.73,83.23 U$10.12
  Bottom 0.61: OS2.C 85.52,95 R15.1
3
  Bottom 0.152: OS12.C 77.06,91.5 69.99,91.5 66.76,88.27 64.08,88.27 63.8,88 62.93,88 59.13,84.19 57.2,84.19 56.47,83.47 U$10.11
  Bottom 0.61: OS12.C 78.02,95 R18.1
4
  Bottom 0.152: OS3.C 69.06,91 65.5,91 64.75,90.25 63.58,90.25 63,89.67 63,88.5 59,84.5 56,84.5 55.2,83.69 U$10.10
  Bottom 0.61: OS3.C 70.52,95 R16.1
5  (via drill 0.35)
  Top 0.152: OS10.C 63.02,89.69 63,89.67 63,89.5 58.5,85 55.16,85 v53.16,83
  Bottom 0.152: v53.16,83 53.16,82.3 U$10.8
  Bottom 0.61: OS10.C 63.02,94.87 R23.1
6
  Bottom 0.152: U$10.6 53.92,80.58 54.45,81.11 54.45,86.36 54.79,86.7 54.79,91.73 OS4.C
  Bottom 0.61: OS4.C 55.52,95 R17.1
7
  Bottom 0.152: U$9.13 47.5,82.31 47.5,91.98 OS7.C
  Bottom 0.61: OS7.C 47.02,95 R22.1
8
  Bottom 0.152: U$9.12 45.02,83.52 45.02,86.96 44.63,87.35 44.63,88.02 44.06,88.59 43.39,88.59 OS6.C
  Bottom 0.61: OS6.C 39.52,95 R21.1
9
  Bottom 0.152: U$9.11 43.77,83.5 41.43,83.5 40.93,84 33.93,84 32,85.93 32,92.44 OS11.C
  Bottom 0.61: OS11.C 32.02,95 R19.1
10
  Bottom 0.152: U$9.10 42.99,83 41.5,83 41,83.5 34,83.5 31.54,85.96 31.54,88.44 29.88,90.11 26,90.11 24.52,91.59 OS8.C
  Bottom 0.61: OS8.C 24.52,95 R25.1
11
  Bottom 0.152: OS9.C 17.34,92.46 20,89.81 29.75,89.81 31.24,88.32 31.24,85.76 34,83 40.45,83 U$9.8
  Bottom 0.61: OS9.C 17.02,95 R24.1
12
  Bottom 0.152: U$9.6 42.88,76.2 42.05,75.37 41.26,75.37 38.75,77.88 31.81,77.88 30.93,78.76 30.93,88.19 29.62,89.5 12.48,89.5 OS1.C
  Bottom 0.61: OS1.C 9.52,95 R14.1
+3V3  (via drill 0.35)
  Top 0.152: Q3.1 53.5,26.88 54.18,27.55 54.18,28.55 53.5,29.22 Q4.1 52.05,29.95 52.05,30.89 47,30.89 | U$4.2 48,48.5 | v51,48.5 51.9,48.5 | 47,30.89 R31.1 | 47,30.89 48.5,32.39 48.5,35 | 48.5,35 48.5,38.5 51,41 v51,45 | R33.1 48.5,35
  Top 0.61: C1.1 51.9,48.5 U$4.TAB v51,48.5 48,48.5
  Bottom 0.152: v51,45 v51,48.5
+5V  (via drill 0.35)
  Top 0.61: R17.2 v51.5,95
  Bottom 0.152: U$9.1 49.5,75.97 v49.5,75 | U$10.1 61,75.47 v61,75
  Bottom 0.61: R14.2 v5.5,95 | R24.2 v13,95 | R25.2 v20.5,95 | R19.2 v28,95 | R21.2 v35.5,95 | R22.2 v43,95 | v51.5,95 R17.2 | R23.2 v59,95 | R16.2 v66.5,95 | R18.2 v74,95 | R15.2 v81.5,95 | R20.2 v89,95
  pour Top: -1,105 106,105 106,-6 -5,-6 -5,105
+12V
  Bottom 0.61: BT2.PWR@1 68,52.9 65.34,50.23 65.34,44.15 64.85,43.66 64.15,43.66 62.42,45.4 R26.2
  Bottom 1.27: JP1.3 64.68,63.15 | JP1.3 65.81,63.15 65.94,63.02 66,63.02 U$1.+ 69.19,54.84 BT2.PWR@1 | U$6.IN+ 54.7,70.97 55.47,70.2 59.49,70.2 60.34,69.35 60.34,66.83 60.2,66.7 60.2,65.05 61.11,64.14 61.52,64.14 JP1.3
ANALOG  (via drill 0.35)
  Top 0.152: M1.J2.12 55.5,21.82 55.5,19 54.51,18.01 53.49,18.01 53.27,17.8 53.27,11.77 v52.5,11 52.5,7.54 v50.96,6
  Bottom 0.152: v50.96,6 50.83,5.87 JP4.2
AOUT1
  Top 0.61: IC1.3 41.78,56.06 41.7,56.06 37.26,51.62 37.26,41.7 24.75,29.19 24.69,29.19 22.5,27 22.5,6.07 J_MOTOR_2.1
AOUT2  (via drill 0.35)
  Top 0.61: IC1.6 51.78,62.5 40.9,62.5 39.99,61.59 39.99,61.49 38,59.5 38,54.5 v37.5,54 | v36.5,39 27.5,30 27.5,11.91 26.74,11.15 26.74,6.17 J_MOTOR_2.2
  Bottom 0.61: v37.5,54 37.5,40 v36.5,39
BOUT1  (via drill 0.35)
  Top 0.61: J_MOTOR_1.1 76.7,18.8 64.5,31 v64.5,44.5 | v59,58 57.47,59.53 57.47,61.59 55.5,63.56 v55.5,64.5
  Bottom 0.61: v64.5,44.5 64.5,52.5 v59,58 | v55.5,64.5 49.78,64.5 IC1.14
BOUT2  (via drill 0.35)
  Top 0.61: J_MOTOR_1.2 74.27,2.73 73.26,3.74 73.26,11.15 72.1,12.31 66,12.31 66,27.5 63.5,30 63.5,43 62.5,44 v62.5,51.86 | IC1.11 v53.81,63.5
  Bottom 0.61: v53.81,63.5 53.81,62.71 54.93,61.59 54.93,59.57 62.5,52 v62.5,51.86
ENA  (via drill 0.35)
  Top 0.152: IC1.1 40,59.36 v40,57
  Bottom 0.152: v40,57 40,36.48 M1.J1.8
ENB
  Top 0.152: M1.J1.9 44,33.18 44,53.5 45.65,55.15 49.15,55.15 52.5,58.5 53.76,58.5 54.89,59.64 54.89,64.75 55.25,65.11 55.61,65.11 58.59,68.09 IC1.9
GND  (via drill 0.35)
  Top 0.152: Q2.2 50.05,82 v50.5,82 | Q1.2 61.05,82 v61.5,82 | LED1.3 58.42,3.5 v57.5,3.5 | 49,53 C1.2
  Top 0.508: JP3.4 30.45,79.36 30.45,75.3 31.23,74.52 31.48,74.52 U$7.1
  Top 0.61: S1.2 68.05,92.46 OS3.E | U1.GND 43.59,4.62 R1.A | U$4.1 47.9,53 | 47.9,53 v47,53 | 47.9,53 49,53 | v47.9,43.5 C2.2
  Bottom 0.152: v50.5,82 50.3,81.8 U$9.14 | v61.5,82 60.48,82 U$10.14
  pour Bottom: -5,108 113,108 113,-8 -11,-8 -11,108
I2
  Bottom 0.152: U$9.3 46.69,76.2 45.25,74.76 40.87,74.76 40.3,75.34 31.81,75.34 30.92,76.23 JP3.2
INA1
  Bottom 0.152: IC1.2 41.5,58.32 41.5,56.5 40.47,55.47 40.47,38.55 M1.J1.7
INA2
  Top 0.152: M1.J1.10 44.5,31.14 44.5,53.5 45.85,54.85 49.5,54.85 52.85,58.2 53.88,58.2 56.16,60.47 IC1.7
INB1
  Bottom 0.152: M1.J1.13 42.38,22.55 39.39,25.54 39.39,63.39 41,65 42.5,65 43.65,66.15 IC1.15
INB2  (via drill 0.35)
  Top 0.152: M1.J1.11 44.8,28.91 44.8,53.3 46.05,54.55 49.63,54.55 52.97,57.89 54.01,57.89 54.71,58.59 v57.09,58.59
  Bottom 0.152: v57.09,58.59 57.09,59.29 57.24,59.44 57.24,67.2 IC1.10
INTERRUPT  (via drill 0.35)
  Top 0.152: Q1.3 Q2.3 R27.1 43.9,74.9 v43,74 | v42.38,66.5 42.38,63.66 v42.52,63.52
  Bottom 0.152: v43,74 42.38,73.38 v42.38,66.5 | M1.J1.5 42.38,42.87 40.97,44.28 40.97,55 44.54,58.57 44.54,61.5 v42.52,63.52
LED
  Top 0.152: R30.2 54.5,10.97 55.17,10.3 55.17,7.9 55.83,7.24 58.08,7.24 LED1.4
N$1  (via drill 0.35)
  Top 0.152: v64.63,16.13 v59.88,20.88
  Bottom 0.152: M1.J2.5 57.62,40.57 58.6,39.59 58.6,22.15 v59.88,20.88 | R1.S 44.17,1.5 68.44,1.5 69.62,2.68 69.62,11.14 v64.63,16.13
N$2
  Bottom 0.61: BT2.GND@1 68,7.5 63.5,12 37,12 34,15 34,51.65 BT1.PWR@1
N$3  (via drill 0.35)
  Top 0.152: Q1.1 v59,75
  Bottom 0.152: v59,75 U$10.2
N$4  (via drill 0.35)
  Top 0.152: Q2.1 v48,75
  Bottom 0.152: v48,75 v48.01,75 U$9.2
N$5
  Bottom 0.152: U$10.3 57.73,77.23 64.75,84.25 S1.3
N$6
  Bottom 0.152: R29.1 54.3,42.6 57.11,42.6 57.21,42.7 58.03,42.7 58.13,42.6 R26.1
  Bottom 0.61: R26.1 R28.2
N$7
  Top 0.61: 9.52,95 R2.2 9.52,95.13 OS1.A
N$8
  Top 0.61: 85.52,95 R3.2 85.52,95.13 OS2.A
N$9
  Top 0.61: 70.52,95 R4.2 70.52,95.13 OS3.A
N$10
  Top 0.61: 32.02,95 R5.2 32.02,95.13 OS11.A
N$11
  Top 0.61: 78.02,95 R6.2 78.02,95.13 OS12.A
N$12
  Top 0.61: 55.52,95 R7.2 55.52,95.13 OS4.A
N$13
  Top 0.61: 93.02,95 R8.2 93.02,95.13 OS5.A
N$14
  Top 0.61: 39.52,95 R10.2 39.52,95.13 OS6.A
N$15
  Top 0.61: 47.02,95 R11.2 47.02,95.13 OS7.A
N$16
  Top 0.61: R12.2 63.02,95.13 OS10.A
N$17
  Top 0.61: 17.02,95 R13.2 17.02,95.13 OS9.A
N$18
  Top 0.61: 24.52,95 R9.2 24.52,95.13 OS8.A
N$19
  Bottom 0.152: D1.C 53.7,39.8 R29.2 56.7,40.1 M1.J2.6
N$20
  Top 0.152: M1.J2.15 55.08,16.32 R30.1
RX_HV
  Top 0.152: Q4.3 57.6,29 M1.J2.10 60.38,29.02 R34.2
RX_LV
  Top 0.152: Q4.2 51.74,29.81 U$3.2 49.03,29.81 48.09,28.87 45.91,28.87 45.77,29 45.77,30.8 47.1,32.12 R33.2
SCL  (via drill 0.35)
  Top 0.152: U$2.SCL2 U$2.SCL 34.12,74.88 33.66,75.34 31.81,75.34 31.24,75.91 31.24,76.73 32.22,77.71 U$7.3 | v49.5,80.5 v53.32,80.5 | v46.13,13.5 U1.SCL | v48.11,90.3 48.11,89.88 47.75,89.52 47.75,89.25 47,88.5 46.69,88.5 46.6,88.59 45.78,88.59 45.21,88.02 45.21,86.71 v44,85.5 | v35.61,86.5 36.35,86.5 R36.1 | v53.85,85 53.85,85.03 U$8.3
  Bottom 0.152: U$7.3 32.22,80.01 31.24,80.99 31.24,81.81 31.81,82.38 39.85,82.38 41.26,80.97 42.05,80.97 42.88,81.8 U$9.9 43.75,80.97 49.03,80.97 v49.5,80.5 | U$2.SCL2 28,61.91 28,12.18 31.33,8.85 38.18,8.85 40.59,11.26 44.05,11.26 46.06,9.25 U1.SCL | v53.32,80.5 53.32,81.39 53.92,82 U$10.9 53.92,84.92 v53.85,85 | v46.13,13.5 46.13,36.64 M1.J2.7 | U$8.3 48.58,90.3 v48.11,90.3 | v44,85.5 36.61,85.5 v35.61,86.5
SDA  (via drill 0.35)
  Top 0.152: 35,84.5 32.22,81.72 U$7.4 30.93,80.11 30.93,75.5 31.43,75 33.32,75 33.82,74.5 33.82,70.27 U$2.SDA | 35,84.5 45.62,84.5 U$8.4 | v50,77.5 v52.5,77.5 | U1.SDA v48.67,13 | 35,84.5 35,86.9 R35.1
  Bottom 0.152: U$2.SDA2 U$2.SDA 31.59,67.23 30.36,66 30.36,64.7 27.7,62.03 27.7,12.05 32.5,7.24 46.59,7.24 48.6,9.25 U1.SDA | U$7.4 36.45,81.4 U$9.7 41.7,76.2 42.53,77.03 49.5,77.03 49.97,77.5 v50,77.5 | v52.5,77.5 52.66,77.34 U$10.7 | M1.J2.8 48.67,34.1 v48.67,13
SERVO  (via drill 0.35)
  Top 0.152: v32,24 42.32,24 M1.J1.12
  Bottom 0.152: M3.1 29.41,26.59 v32,24
STATE
  Top 0.152: M1.J2.9 50.79,31.56 U$3.1
SW1  (via drill 0.35)
  Top 0.152: JP2.2 71.27,76 v69,76
  Bottom 0.152: v69,76 63.5,76 61.5,74 57.44,74 55.94,75.5 55.94,75.56 55.3,76.2 U$10.5
SW2
  Bottom 0.152: U$9.5 44.15,76.2 43.02,75.07 41,75.07 38.76,77.3 29.97,77.3 JP3.3
TX_HV
  Top 0.152: M1.J2.11 56.98,26.48 Q3.3 55.5,24.88 54.05,23.42 54.02,23.42 R32.2
TX_LV
  Top 0.152: Q3.2 50.28,27.27 U$3.3 50,27.1 R31.2
VMOT
  Bottom 1.27: IC1.8 62.38,60.47 JP1.2

### Text on the board
bPlace: StanislavJochman | Designed in Slovakia | A | B
tNames: 1 | 2 | 3 | 4 | 5 | 6 | 7 | 8 | 9 | 10 | 11 | 12 | I2C | Servo